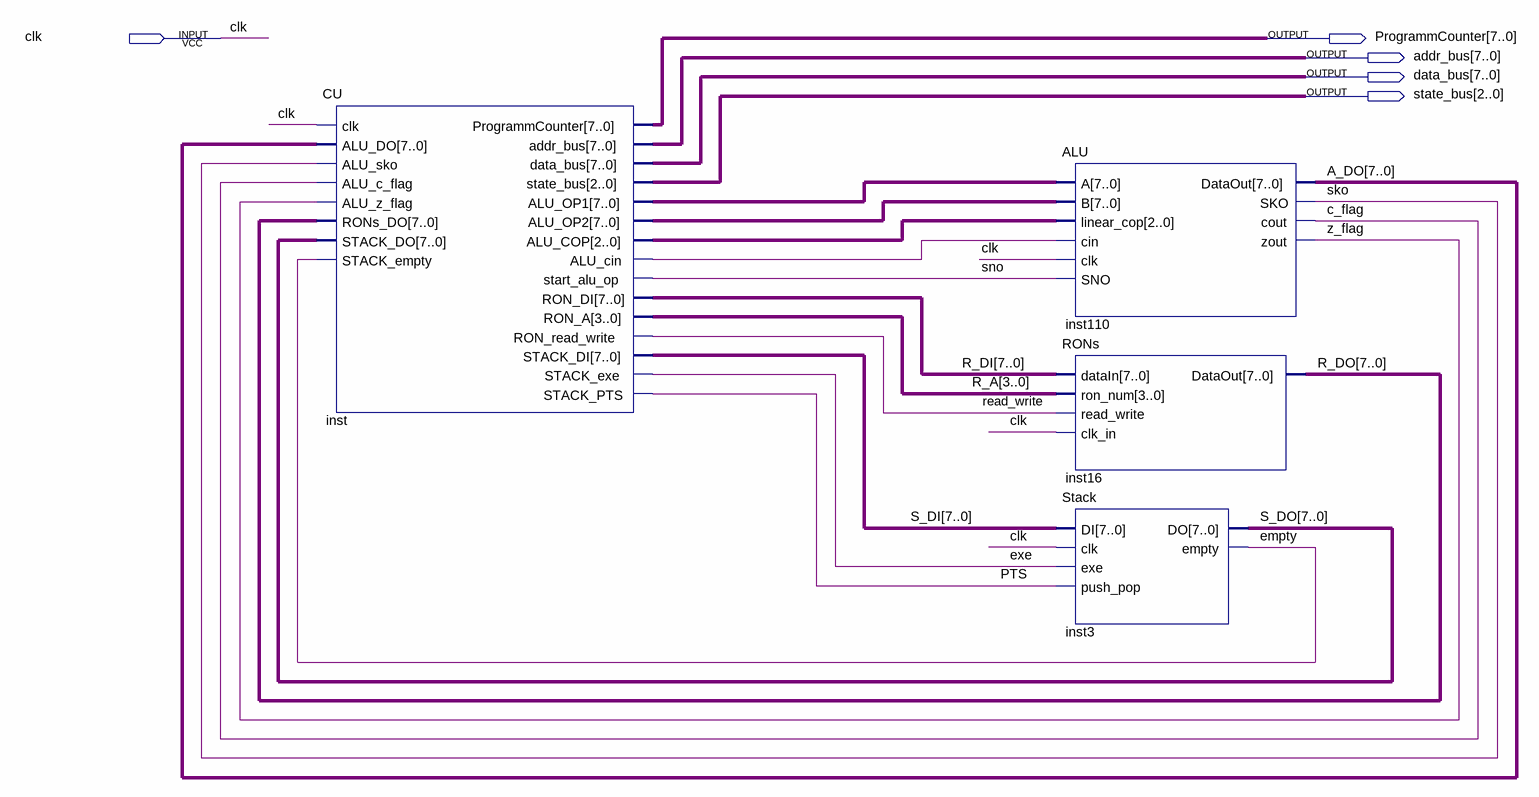
[diagram p0: schematic sheet]
// Quartus schematic CPU.bdf as structural Verilog: 4 symbols, 5 pins
module CPU (
  input  clk,
  output [7:0] ProgrammCounter,
  output [7:0] addr_bus,
  output [7:0] data_bus,
  output [2:0] state_bus
);

  wire c_flag, empty, exe, inst_alu_cin, PTS, read_write, sko, sno, z_flag;
  wire [2:0] inst_alu_cop;
  wire [3:0] R_A;
  wire [7:0] A_DO, inst_alu_op1, inst_alu_op2, R_DI, R_DO, S_DI, S_DO;

  CU inst (
    .clk(clk), .ALU_sko(sko), .ALU_c_flag(c_flag), .ALU_z_flag(z_flag), .STACK_empty(empty), .ALU_DO(A_DO),
    .RONs_DO(R_DO), .STACK_DO(S_DO), .state_bus(state_bus), .ALU_COP(inst_alu_cop), .ALU_cin(inst_alu_cin),
    .start_alu_op(sno), .RON_A(R_A), .RON_read_write(read_write), .STACK_exe(exe), .STACK_PTS(PTS),
    .ProgrammCounter(ProgrammCounter), .addr_bus(addr_bus), .data_bus(data_bus), .ALU_OP1(inst_alu_op1),
    .ALU_OP2(inst_alu_op2), .RON_DI(R_DI), .STACK_DI(S_DI));
  ALU inst110 (
    .linear_cop(inst_alu_cop), .cin(inst_alu_cin), .clk(clk), .SNO(sno), .A(inst_alu_op1), .B(inst_alu_op2),
    .SKO(sko), .cout(c_flag), .zout(z_flag), .DataOut(A_DO));
  RONs inst16 (.ron_num(R_A), .read_write(read_write), .clk_in(clk), .dataIn(R_DI), .DataOut(R_DO));
  Stack inst3 (.clk(clk), .exe(exe), .push_pop(PTS), .DI(S_DI), .empty(empty), .DO(S_DO));
endmodule
